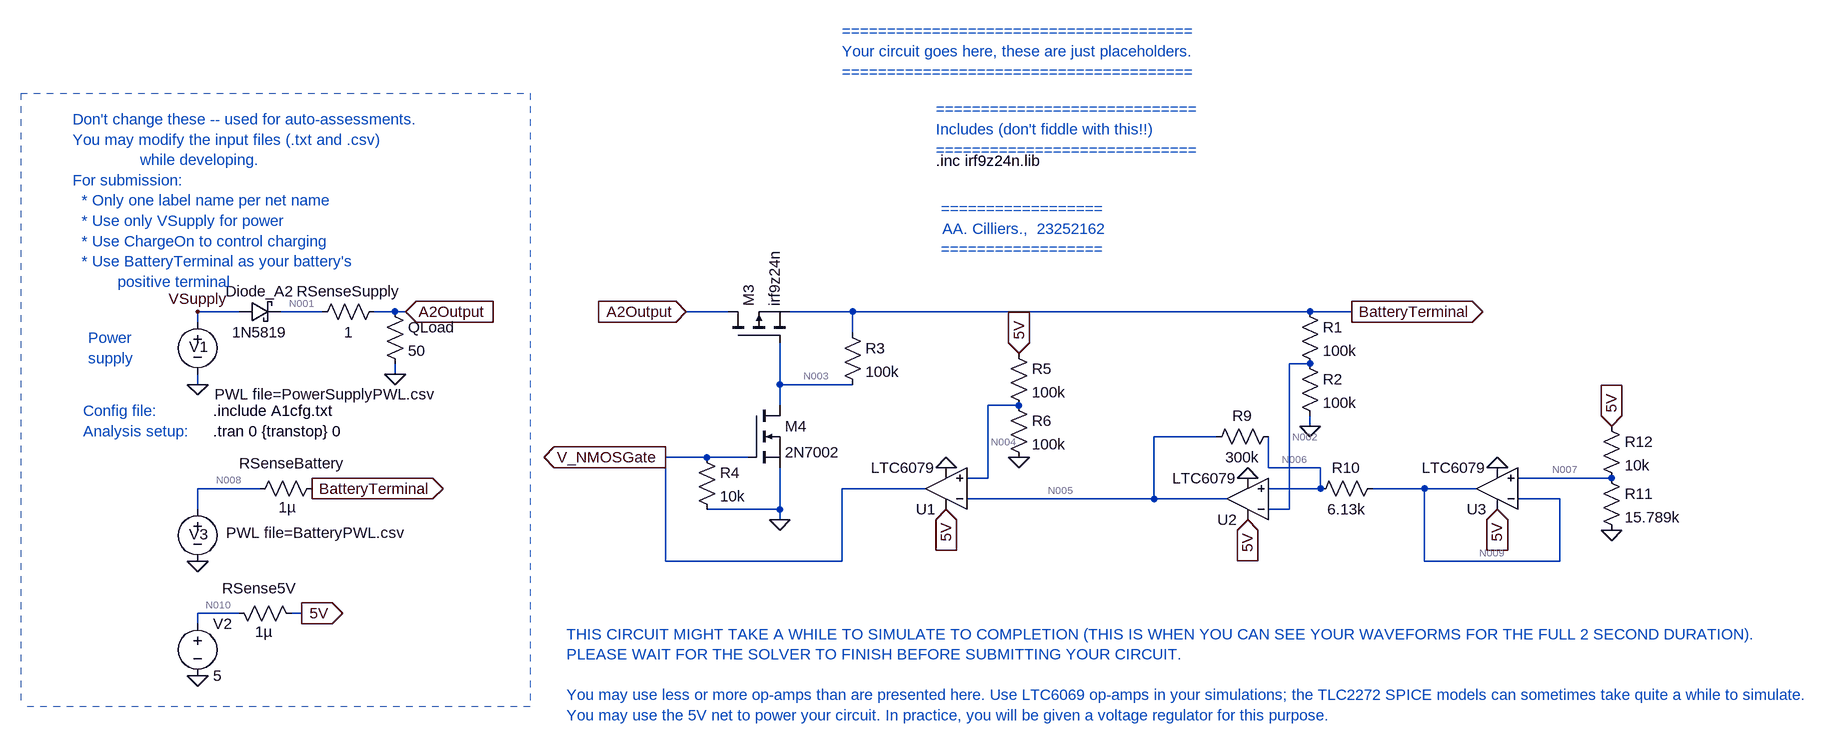
[diagram p0: schematic E344_23252162_A3.asc]
E344_23252162_A3.asc, the LTspice schematic file:
Version 4
SHEET 1 1824 680
WIRE -2032 -1088 -2096 -1088
WIRE -1904 -1088 -1968 -1088
WIRE -1792 -1088 -1824 -1088
WIRE -1776 -1088 -1792 -1088
WIRE -1280 -1088 -1344 -1088
WIRE -1088 -1088 -1184 -1088
WIRE -384 -1088 -1088 -1088
WIRE -320 -1088 -384 -1088
WIRE -2096 -1072 -2096 -1088
WIRE -1088 -1056 -1088 -1088
WIRE -384 -1008 -416 -1008
WIRE -1792 -992 -1792 -1008
WIRE -2096 -976 -2096 -992
WIRE -1200 -976 -1200 -1040
WIRE -1088 -976 -1200 -976
WIRE -1200 -944 -1200 -976
WIRE -832 -944 -880 -944
WIRE -384 -912 -384 -928
WIRE -528 -896 -624 -896
WIRE -1312 -864 -1376 -864
WIRE -1248 -864 -1312 -864
WIRE -448 -848 -448 -896
WIRE -368 -848 -448 -848
WIRE -880 -832 -880 -944
WIRE -880 -832 -912 -832
WIRE 80 -832 -64 -832
WIRE -2000 -816 -2096 -816
WIRE -976 -816 -1104 -816
WIRE -368 -816 -368 -848
WIRE -368 -816 -448 -816
WIRE -208 -816 -288 -816
WIRE -128 -816 -208 -816
WIRE -624 -800 -624 -896
WIRE -624 -800 -912 -800
WIRE -512 -800 -624 -800
WIRE 0 -800 -64 -800
WIRE -2096 -784 -2096 -816
WIRE -1200 -784 -1200 -848
WIRE -1200 -784 -1312 -784
WIRE -416 -784 -416 -1008
WIRE -416 -784 -448 -784
WIRE -1200 -768 -1200 -784
WIRE -1376 -704 -1376 -864
WIRE -1104 -704 -1104 -816
WIRE -1104 -704 -1376 -704
WIRE -208 -704 -208 -816
WIRE 0 -704 0 -800
WIRE 0 -704 -208 -704
WIRE -2032 -624 -2096 -624
WIRE -1936 -624 -1952 -624
WIRE -2096 -608 -2096 -624
FLAG -2096 -976 0
FLAG -1776 -1088 A2Output
IOPIN -1776 -1088 In
FLAG -1920 -816 BatteryTerminal
IOPIN -1920 -816 Out
FLAG -2096 -704 0
FLAG -1936 -624 5V
IOPIN -1936 -624 Out
FLAG -2096 -1088 VSupply
FLAG -1792 -992 0
FLAG -2096 -528 0
FLAG -320 -1088 BatteryTerminal
IOPIN -320 -1088 Out
FLAG -1344 -1088 A2Output
IOPIN -1344 -1088 In
FLAG -832 -1024 5V
IOPIN -832 -1024 In
FLAG -1200 -768 0
FLAG -480 -768 5V
IOPIN -480 -768 In
FLAG -96 -784 5V
IOPIN -96 -784 In
FLAG 80 -912 5V
IOPIN 80 -912 In
FLAG -480 -832 0
FLAG -96 -848 0
FLAG -944 -784 5V
IOPIN -944 -784 In
FLAG -944 -848 0
FLAG -384 -912 0
FLAG 80 -752 0
FLAG -832 -864 0
FLAG -1376 -864 V_NMOSGate
IOPIN -1376 -864 Out
SYMBOL voltage -2096 -1088 R0
WINDOW 123 0 0 Left 0
WINDOW 39 0 0 Left 0
WINDOW 3 26 127 Left 2
WINDOW 0 -13 54 Left 2
SYMATTR Value PWL file=PowerSupplyPWL.csv
SYMATTR InstName V1
SYMBOL res -1904 -832 R90
WINDOW 0 -7 47 VBottom 2
WINDOW 3 29 54 VTop 2
SYMATTR InstName RSenseBattery
SYMATTR Value 1µ
SYMBOL schottky -2032 -1072 R270
WINDOW 0 32 32 VTop 2
WINDOW 3 0 32 VBottom 2
SYMATTR InstName Diode_A2
SYMATTR Value 1N5819
SYMATTR Description Diode
SYMATTR Type diode
SYMBOL voltage -2096 -800 R0
WINDOW 123 0 0 Left 0
WINDOW 39 0 0 Left 0
WINDOW 3 44 52 Left 2
WINDOW 0 -13 54 Left 2
SYMATTR Value PWL file=BatteryPWL.csv
SYMATTR InstName V3
SYMBOL res -1920 -1072 R270
WINDOW 0 32 56 VTop 2
WINDOW 3 0 56 VBottom 2
SYMATTR InstName RSenseSupply
SYMATTR Value 1
SYMBOL res -1808 -1104 R0
SYMATTR InstName QLoad
SYMATTR Value 50
SYMBOL voltage -2096 -624 R0
WINDOW 123 0 0 Left 0
WINDOW 39 0 0 Left 0
SYMATTR InstName V2
SYMATTR Value 5
SYMBOL res -2048 -640 M90
WINDOW 0 -7 47 VBottom 2
WINDOW 3 29 54 VTop 2
SYMATTR InstName RSense5V
SYMATTR Value 1µ
SYMBOL pmos -1280 -1040 R270
SYMATTR InstName M3
SYMATTR Value irf9z24n
SYMATTR Prefix X
SYMATTR SpiceModel irf9z24n
SYMBOL nmos -1248 -944 R0
SYMATTR InstName M4
SYMATTR Value 2N7002
SYMBOL OpAmps\\LTC6079 -944 -816 R180
SYMATTR InstName U1
SYMBOL OpAmps\\LTC6079 -480 -800 R180
SYMATTR InstName U2
SYMBOL OpAmps\\LTC6079 -96 -816 R180
SYMATTR InstName U3
SYMBOL res -400 -1104 R0
SYMATTR InstName R1
SYMATTR Value 100k
SYMBOL res -400 -1024 R0
SYMATTR InstName R2
SYMATTR Value 100k
SYMBOL res -1104 -1072 R0
SYMATTR InstName R3
SYMATTR Value 100k
SYMBOL res -1328 -880 R0
SYMATTR InstName R4
SYMATTR Value 10k
SYMBOL res -848 -1040 R0
SYMATTR InstName R5
SYMATTR Value 100k
SYMBOL res -848 -960 R0
SYMATTR InstName R6
SYMATTR Value 100k
SYMBOL res -432 -912 R90
WINDOW 0 0 56 VBottom 2
WINDOW 3 32 56 VTop 2
SYMATTR InstName R9
SYMATTR Value 300k
SYMBOL res -272 -832 R90
WINDOW 0 0 56 VBottom 2
WINDOW 3 32 56 VTop 2
SYMATTR InstName R10
SYMATTR Value 6.13k
SYMBOL res 64 -848 R0
SYMATTR InstName R11
SYMATTR Value 15.789k
SYMBOL res 64 -928 R0
SYMATTR InstName R12
SYMATTR Value 10k
TEXT -2072 -904 Left 2 !.tran 0 {transtop} 0
TEXT -2072 -936 Left 2 !.include A1cfg.txt
TEXT -2288 -1384 Left 2 ;Don't change these -- used for auto-assessments.\nYou may modify the input files (.txt and .csv) \n               while developing.\nFor submission: \n  * Only one label name per net name\n  * Use only VSupply for power\n  * Use ChargeOn to control charging\n  * Use BatteryTerminal as your battery's \n          positive terminal
TEXT -2272 -936 Left 2 ;Config file:
TEXT -2272 -904 Left 2 ;Analysis setup:
TEXT -2264 -1048 Left 2 ;Power\nsupply
TEXT -824 -1216 Center 2 ;==================\nAA. Cilliers.,  23252162\n==================
TEXT -960 -1320 Left 2 !.inc irf9z24n.lib
TEXT -960 -1400 Left 2 ;=============================\nIncludes (don't fiddle with this!!)\n=============================
TEXT -1104 -1520 Left 2 ;=======================================\nYour circuit goes here, these are just placeholders.\n=======================================
TEXT -1528 -592 Left 2 ;THIS CIRCUIT MIGHT TAKE A WHILE TO SIMULATE TO COMPLETION (THIS IS WHEN YOU CAN SEE YOUR WAVEFORMS FOR THE FULL 2 SECOND DURATION).\nPLEASE WAIT FOR THE SOLVER TO FINISH BEFORE SUBMITTING YOUR CIRCUIT.\n \nYou may use less or more op-amps than are presented here. Use LTC6069 op-amps in your simulations; the TLC2272 SPICE models can sometimes take quite a while to simulate.\nYou may use the 5V net to power your circuit. In practice, you will be given a voltage regulator for this purpose.
LINE Normal -1584 -1424 -1584 -480 2
LINE Normal -2368 -1424 -1584 -1424 2
LINE Normal -1584 -480 -2368 -480 2
LINE Normal -1584 -496 -1584 -496 2
LINE Normal -2368 -1424 -2368 -480 2

The netlist it stands for:
* E344_23252162_A3.asc
V1 VSupply 0 PWL file=PowerSupplyPWL.csv
RSenseBattery BatteryTerminal N008 1µ
Diode_A2 VSupply N001 1N5819
V3 N008 0 PWL file=BatteryPWL.csv
RSenseSupply N001 A2Output 1
R§QLoad A2Output 0 50
V2 N010 0 5
RSense5V N010 5V 1µ
XM3 A2Output N003 BatteryTerminal irf9z24n irf9z24n  ; pins D G S
M4 N003 V_NMOSGate 0 0 2N7002
XU1 N004 N005 5V 0 V_NMOSGate LTC6078  ; LTC6079, pins In+ In- V+ V- OUT
XU2 N006 N002 5V 0 N005 LTC6078  ; LTC6079, pins In+ In- V+ V- OUT
XU3 N007 N009 5V 0 N009 LTC6078  ; LTC6079, pins In+ In- V+ V- OUT
R1 BatteryTerminal N002 100k
R2 N002 0 100k
R3 BatteryTerminal N003 100k
R4 V_NMOSGate 0 10k
R5 5V N004 100k
R6 N004 0 100k
R9 N006 N005 300k
R10 N009 N006 6.13k
R11 N007 0 15.789k
R12 5V N007 10k
.model D D
.lib standard.dio
.model NMOS NMOS
.model PMOS PMOS
.lib standard.mos
.tran 0 {transtop} 0
.include A1cfg.txt
* Don't change these -- used for auto-assessments.
* You may modify the input files (.txt and .csv)
*                while developing.
* For submission:
*   * Only one label name per net name
*   * Use only VSupply for power
*   * Use ChargeOn to control charging
*   * Use BatteryTerminal as your battery's
*           positive terminal
* Config file:
* Analysis setup:
* Power
* supply
* ==================
* AA. Cilliers.,  23252162
* ==================
.inc irf9z24n.lib
* =============================
* Includes (don't fiddle with this!!)
* =============================
* =======================================
* Your circuit goes here, these are just placeholders.
* =======================================
* THIS CIRCUIT MIGHT TAKE A WHILE TO SIMULATE TO COMPLETION (THIS IS WHEN YOU CAN SEE YOUR WAVEFORMS FOR THE FULL 2 SECOND DURATION).
* PLEASE WAIT FOR THE SOLVER TO FINISH BEFORE SUBMITTING YOUR CIRCUIT.
* You may use less or more op-amps than are presented here. Use LTC6069 op-amps in your simulations; the TLC2272 SPICE models can sometimes take quite a while to simulate.
* You may use the 5V net to power your circuit. In practice, you will be given a voltage regulator for this purpose.
.lib LTC5.lib
.backanno
.end

* Results of the author's LTspice run, read from the files saved beside the schematic
* Operating Point, zero values left out:
*   V(vsupply) = 7.4 V
*   V(batteryterminal) = 6.3 V
*   V(n008) = 6.3 V
*   V(n001) = 7.019 V
*   V(a2output) = 6.412 V
*   V(n010) = 5 V
*   V(5v) = 5 V
*   V(n003) = 135.1 µV
*   V(v_nmosgate) = 4.974 V
*   V(n004) = 2.5 V
*   V(n005) = 556.2 µV
*   V(n006) = 3 V
*   V(n002) = 3.15 V
*   V(n007) = 3.061 V
*   V(n009) = 3.061 V
*   Id(M4) = 63 µA
*   Is(M4) = -63 µA
*   I(Diode_a2) = 606.6 mA
*   I(R12) = 193.9 µA
*   I(R11) = 193.9 µA
*   I(R10) = 9.998 µA
*   I(R9) = 9.998 µA
*   I(R6) = 25 µA
*   I(R5) = 25 µA
*   I(R4) = 497.4 µA
*   I(R3) = 63 µA
*   I(R2) = 31.5 µA
*   I(R1) = 31.5 µA
*   I(Rsense5v) = 848.7 µA
*   I(Qload) = 128.2 mA
*   I(Rsensesupply) = 606.6 mA
*   I(Rsensebattery) = 478.2 mA
*   I(V2) = -848.7 µA
*   I(V3) = 478.2 mA
*   I(V1) = -606.6 mA
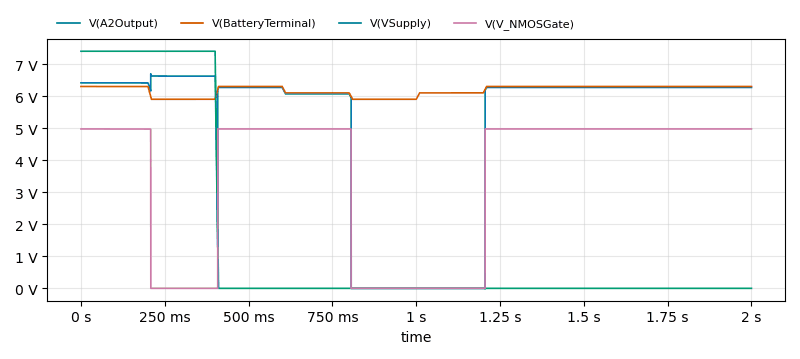
[diagram p1: Transient Analysis of E344_23252162_A3.asc, plotted from the saved traces]
* Transient Analysis, 1 run:
*   V(A2Output): min -15.81 mV, max 6.696 V, average 5.036 V, rms 5.634 V, last 6.27 V
*   V(BatteryTerminal): min 5.9 V, max 6.3 V, average 6.18 V, rms 6.182 V, last 6.3 V
*   V(VSupply): min 0 V, max 7.4 V, average 1.499 V, rms 3.323 V, last 0 V
*   V(V_NMOSGate): min 26.05 µV, max 4.974 V, average 3.482 V, rms 4.162 V, last 4.974 V